# Altium schematic sheet Sheet1.SchDoc
size A4
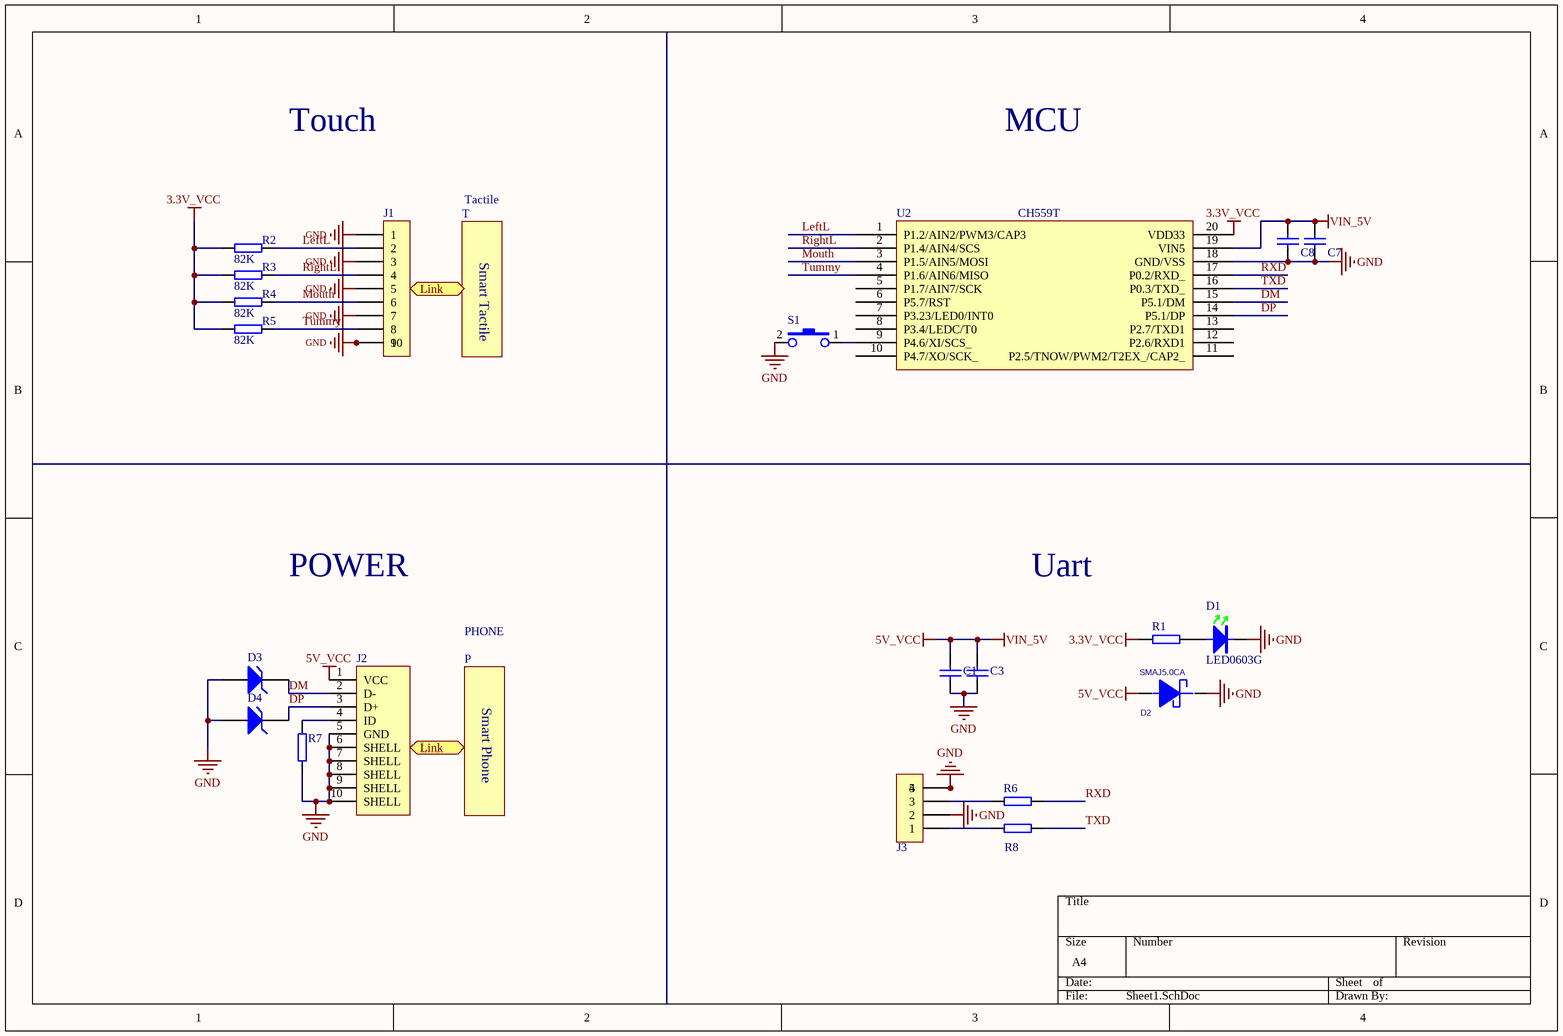
[diagram p0: Sheet1.SchDoc]

## Parts
C1  226M50V  [C0805]  (value not drawn)
C3  105K16V  [C0603]  (value not drawn)
C7  106K50V  [C0603]  (value not drawn)
C8  104K50V  [C0603]  (value not drawn)
D1  LED0603G  [D-LED0603G]
D2  SMAJ5.0CA  [DO-214]
D3  ESDA_TR1/0603  [HS_0603D]  (value not drawn)
D4  ESDA_TR1/0603  [HS_0603D]  (value not drawn)
J1  SH1.0-T-1-LT-8A_卧式  [J-SH1.0-T-1-LT-8A_卧式]  (value not drawn)
J2  USB-MINI-SOCKET  [MICRO-USB - 5.9]  (value not drawn)
J3  SH1.0-T-1-LT-3A_卧式  [J-SH1.0-T-1-LT-3A_卧式]  (value not drawn)
P  PHONE
R1  2K  [R0603]  (value not drawn)
R2  82K  [R0603]
R3  82K  [R0603]
R4  82K  [R0603]
R5  82K  [R0603]
R6  22R  [R0603]  (value not drawn)
R7  0R  [R0603]  (value not drawn)
R8  22R  [R0603]  (value not drawn)
S1  2*3*0.65  [S-K2*3 - duplicate]  (value not drawn)
T  Tactile
U2  CH559T  [TSSOP20]

## Ports
Link

## Nets
3.3V_VCC: R1.2 R2.1 R3.1 R4.1 R5.1 U2.20(VDD33)
5V_VCC: C1.1 C3.1 C7.2 C8.1 D2.1(+) J2.1(VCC) U2.19(VIN5)  [also labelled VIN_5V]
GND: C1.2 C3.2 C7.1 C8.2 D1.2 D2.2(-) D3.1(A) D4.1(A) J1.1 J1.3 J1.5 J1.7 J1.9 J1.10 J2.5(GND) J2.6(SHELL) J2.7(SHELL) J2.8(SHELL) J2.9(SHELL) J2.10(SHELL) J3.2 J3.4 J3.5 R7.1 S1.2 U2.18(GND/VSS)
DM: D3.2(K) J2.2(D-) U2.15(P5.1/DM)
DP: D4.2(K) J2.3(D+) U2.14(P5.1/DP)
LeftL: J1.2 R2.2 U2.1(P1.2/AIN2/PWM3/CAP3)
Mouth: J1.6 R4.2 U2.3(P1.5/AIN5/MOSI)
RightL: J1.4 R3.2 U2.2(P1.4/AIN4/SCS)
RXD: R6.1 U2.17(P0.2/RXD_)
Tummy: J1.8 R5.2 U2.4(P1.6/AIN6/MISO)
TXD: R8.1 U2.16(P0.3/TXD_)
NetD1_1: D1.1 R1.1
NetJ2_4: J2.4(ID) R7.2
NetJ3_1: J3.1 R8.2
NetJ3_3: J3.3 R6.2
NetS1_1: S1.1 U2.9(P4.6/XI/SCS_)

Not connected (* = marked no-connect by the designer): U2 5(P1.7/AIN7/SCK) 6(P5.7/RST) 7(P3.23/LED0/INT0) 8(P3.4/LEDC/T0) 10(P4.7/XO/SCK_) 11(P2.5/TNOW/PWM2/T2EX_/CAP2_) 12(P2.6/RXD1) 13(P2.7/TXD1)

## Notes on the sheet
- Touch
- MCU
- POWER
- Uart
- (in symbol PHONE) Smart Phone
- (in symbol Tactile) Smart Tactile

## Library data of the parts
C1 = C0805Y5V-226M50V: 贴片电容-陶瓷; 规格型号: 22uF±20%_50V_Y5V_C0805; 生产商: 风华 三星; 供应商: *; 备注: *
C3 = C0603X7R-105K16V: 贴片电容-陶瓷; 规格型号: 1uF±10%_16V_X7R_C0603; 生产商: 风华 三星; 供应商: *; 备注: *
C7 = C0603X7R-106K50V: 贴片电容-陶瓷; 规格型号: 10uF±10%_50V_X7R_C0603; 生产商: 风华 三星; 供应商: *; 备注: *
C8 = C0603X7R-104K50V: 贴片电容-陶瓷; 规格型号: 100nF±10%_50V_X7R_C0603; 生产商: 风华 三星; 供应商: *; 备注: *
D1 = DLED-0603-G: 贴片二极管-LED; 规格型号: 0603-GREEN; 货品编码: 无样品无编码; 生产商: *; 供应商: *; 备注: *
D3 D4 = D Zener: Zener Diode; Published: *; LatestRevisionDate: *; LatestRevisionNote: *; PackageReference: *; Publisher: *
J1 = SH1.0-T-1-LT-8A_卧式: SH1.0-T-1-LT-6A_卧式
J2 = J-USB-MINI-SOCKET: USB-A卧式插座; 供应商: *; 备注: *
R1-R6 R8 = R0603-100RF: 贴片电阻-通用; 生产商: 厚声 国巨; 规格型号: 100R±1%_1/10W_±200ppm_R0603; 备注: *; 供应商: *
R7 = R0603-0R: 贴片电阻-通用; 生产商: 厚声 国巨; 规格型号: 0R_1/10W_±200ppm_R0603; 货品编码: 无样品无编码; 备注: *; 供应商: *
S1 = 2*3*0.65 薄膜按键: 薄膜按键
U2 = CH559T: usb通信
D2 = SMAJ5.0CA: PCB DECAL: DO-214; Value: SMAJ5.0CA